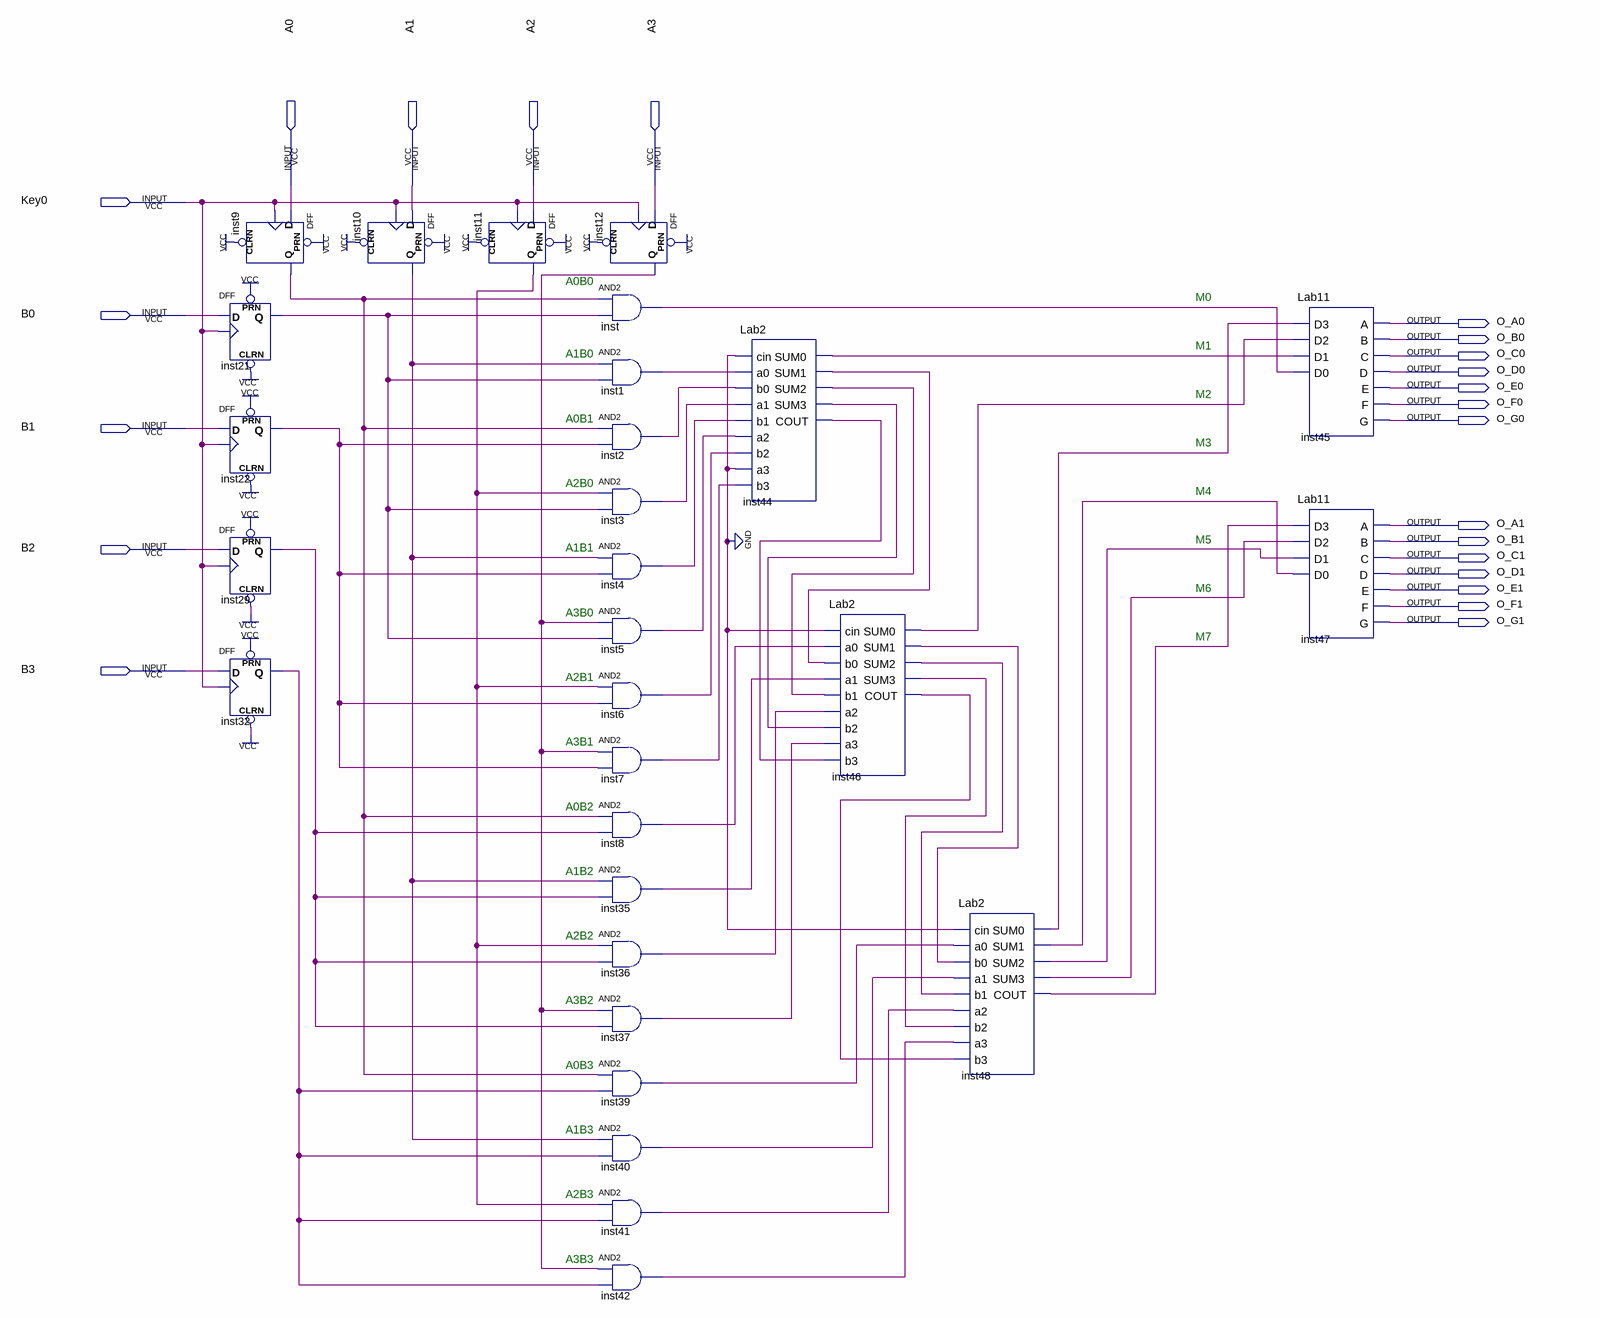
[diagram p0: schematic sheet]
// Quartus schematic Lab3.bdf as structural Verilog: 29 symbols, 23 pins
module Lab3 (
  input  A0,
  input  A1,
  input  A2,
  input  A3,
  input  Key0,
  input  B0,
  input  B1,
  input  B2,
  input  B3,
  output O_A0,
  output O_B0,
  output O_C0,
  output O_D0,
  output O_E0,
  output O_F0,
  output O_G0,
  output O_A1,
  output O_B1,
  output O_C1,
  output O_D1,
  output O_E1,
  output O_F1,
  output O_G1
);

  wire inst1_out, inst2_out, inst3_out, inst4_out, inst5_out, inst6_out, inst7_out, inst8_out, inst9_q,
       inst10_q, inst11_q, inst12_q, inst21_q, inst22_q, inst29_q, inst32_q, inst35_out, inst36_out,
       inst37_out, inst39_out, inst40_out, inst41_out, inst42_out, inst44_cout, inst44_sum0, inst44_sum1,
       inst44_sum2, inst44_sum3, inst46_cout, inst46_sum0, inst46_sum1, inst46_sum2, inst46_sum3,
       inst48_cout, inst48_sum0, inst48_sum1, inst48_sum2, inst48_sum3, inst_out;

  DFF inst9 (.CLRN(1'b1), .CLK(Key0), .D(A0), .PRN(1'b1), .Q(inst9_q));
  DFF inst21 (.CLRN(1'b1), .CLK(Key0), .D(B0), .PRN(1'b1), .Q(inst21_q));
  DFF inst22 (.CLRN(1'b1), .CLK(Key0), .D(B1), .PRN(1'b1), .Q(inst22_q));
  DFF inst29 (.CLRN(1'b1), .CLK(Key0), .D(B2), .PRN(1'b1), .Q(inst29_q));
  DFF inst32 (.CLRN(1'b1), .CLK(Key0), .D(B3), .PRN(1'b1), .Q(inst32_q));
  DFF inst10 (.CLRN(1'b1), .CLK(Key0), .D(A1), .PRN(1'b1), .Q(inst10_q));
  DFF inst11 (.CLRN(1'b1), .CLK(Key0), .D(A2), .PRN(1'b1), .Q(inst11_q));
  DFF inst12 (.CLRN(1'b1), .CLK(Key0), .D(A3), .PRN(1'b1), .Q(inst12_q));
  and inst (inst_out, inst9_q, inst21_q);
  and inst1 (inst1_out, inst10_q, inst21_q);
  and inst2 (inst2_out, inst9_q, inst22_q);
  and inst3 (inst3_out, inst11_q, inst21_q);
  and inst4 (inst4_out, inst10_q, inst22_q);
  and inst5 (inst5_out, inst12_q, inst21_q);
  and inst6 (inst6_out, inst11_q, inst22_q);
  and inst7 (inst7_out, inst12_q, inst22_q);
  and inst8 (inst8_out, inst9_q, inst29_q);
  and inst35 (inst35_out, inst10_q, inst29_q);
  and inst36 (inst36_out, inst11_q, inst29_q);
  and inst37 (inst37_out, inst12_q, inst29_q);
  and inst39 (inst39_out, inst9_q, inst32_q);
  and inst40 (inst40_out, inst10_q, inst32_q);
  and inst41 (inst41_out, inst11_q, inst32_q);
  and inst42 (inst42_out, inst12_q, inst32_q);
  Lab2 inst44 (
    .cin(1'b0), .a0(inst1_out), .b0(inst2_out), .a1(inst3_out), .b1(inst4_out), .a2(inst5_out),
    .b2(inst6_out), .a3(1'b0), .b3(inst7_out), .SUM0(inst44_sum0), .SUM1(inst44_sum1), .SUM2(inst44_sum2),
    .SUM3(inst44_sum3), .COUT(inst44_cout));
  Lab2 inst46 (
    .cin(1'b0), .a0(inst8_out), .b0(inst44_sum1), .a1(inst35_out), .b1(inst44_sum2), .a2(inst36_out),
    .b2(inst44_sum3), .a3(inst37_out), .b3(inst44_cout), .SUM0(inst46_sum0), .SUM1(inst46_sum1),
    .SUM2(inst46_sum2), .SUM3(inst46_sum3), .COUT(inst46_cout));
  Lab2 inst48 (
    .cin(1'b0), .a0(inst39_out), .b0(inst46_sum1), .a1(inst40_out), .b1(inst46_sum2), .a2(inst41_out),
    .b2(inst46_sum3), .a3(inst42_out), .b3(inst46_cout), .SUM0(inst48_sum0), .SUM1(inst48_sum1),
    .SUM2(inst48_sum2), .SUM3(inst48_sum3), .COUT(inst48_cout));
  Lab11 inst45 (
    .D3(inst48_sum0), .D2(inst46_sum0), .D1(inst44_sum0), .D0(inst_out), .A(O_A0), .B(O_B0), .C(O_C0),
    .D(O_D0), .E(O_E0), .F(O_F0), .G(O_G0));
  Lab11 inst47 (
    .D3(inst48_cout), .D2(inst48_sum3), .D1(inst48_sum2), .D0(inst48_sum1), .A(O_A1), .B(O_B1), .C(O_C1),
    .D(O_D1), .E(O_E1), .F(O_F1), .G(O_G1));

  // Notes on the sheet:
  //   A0B0
  //   M0
  //   M1
  //   A1B0
  //   M2
  //   A0B1
  //   M3
  //   A2B0
  //   M4
  //   M5
  //   A1B1
  //   M6
  //   A3B0
  //   M7
  //   A2B1
  //   A3B1
  //   A0B2
  //   A1B2
  //   A2B2
  //   A3B2
  //   A0B3
  //   A1B3
  //   A2B3
  //   A3B3
endmodule
